# EAGLE board BB-cape (EAGLE 9.7.0)
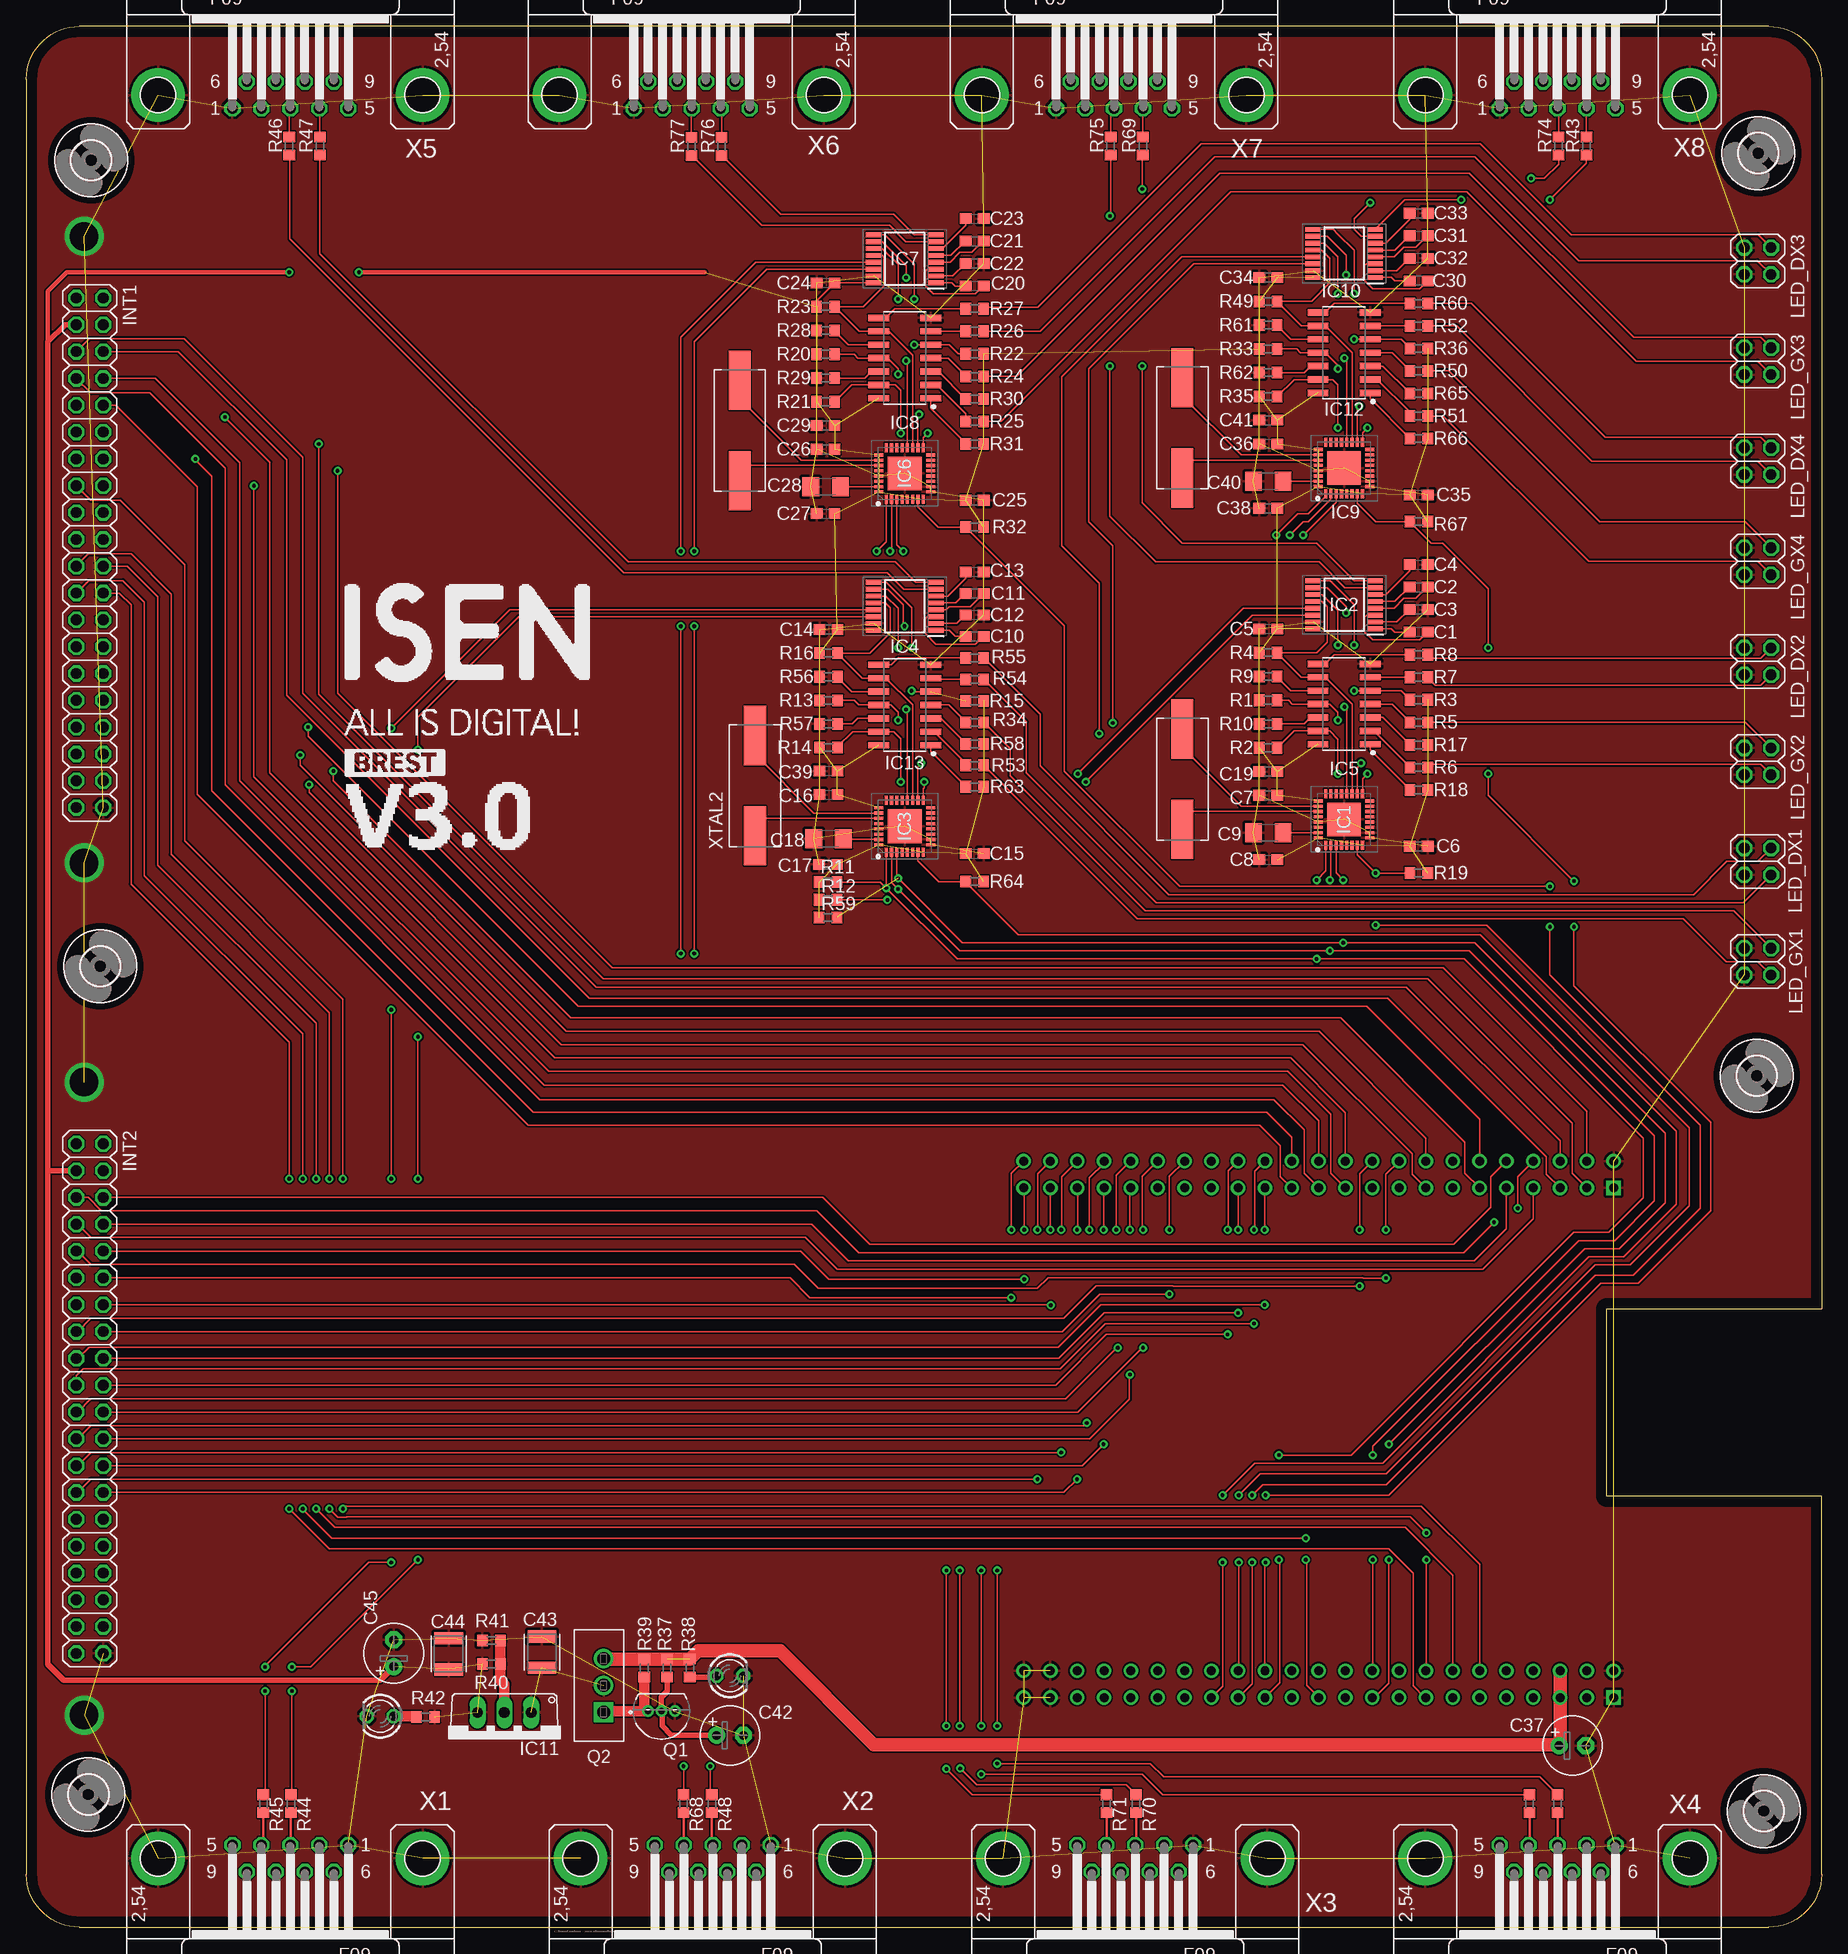
[diagram p2: board, top side]
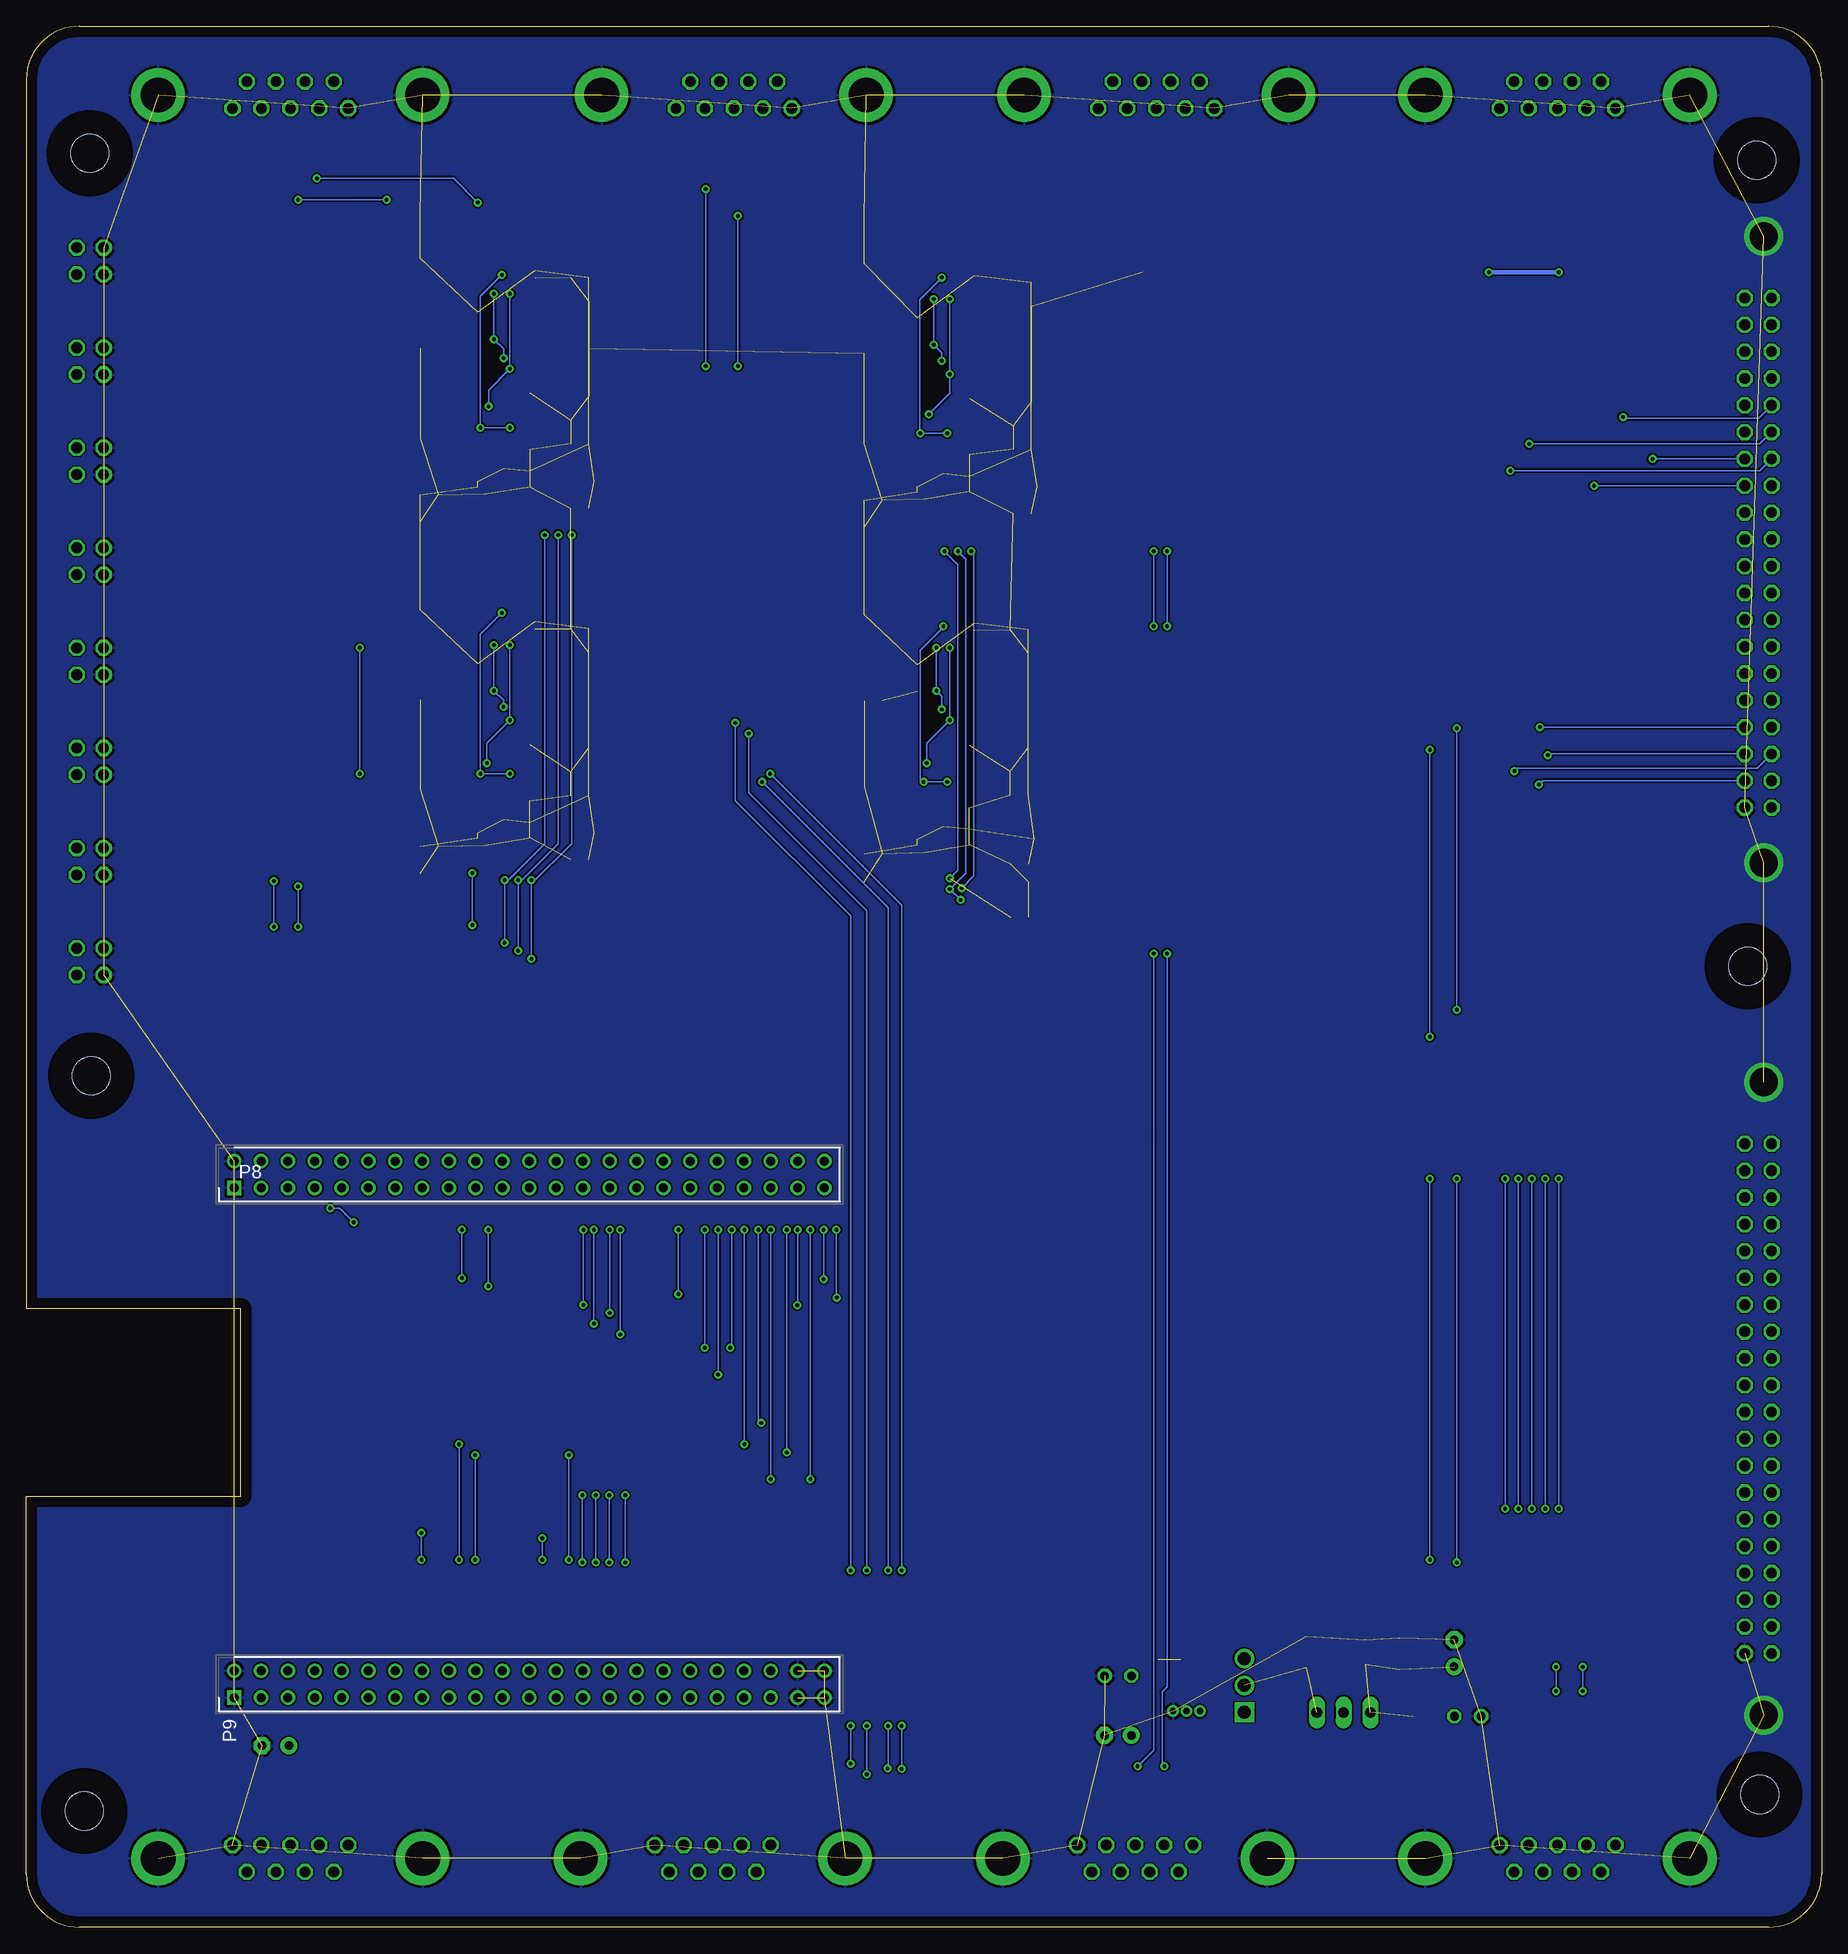
[diagram p3: board, bottom side, seen from below]

Size 170 x 180 mm. Coordinates in mm from the lower left corner, seen from the top.
Outline: 5,0 165,0 arc90 170,5 170,40.79 149.68,40.79 149.68,58.57 170,58.57 170,175 arc90 165,180 5,180 arc90 0,175 0,5 arc90 5,0
Copper layers (1*16): Top 0.035mm / dielectric 1.5mm / Bottom 0.035mm
Design rules "Fusion Electronics Design Rules": minimum track width 6mil, minimum drill 0.35mm, track to track 6mil, track to pad 6mil, pad to pad 6mil, via to via 6mil, smd to smd 6mil, copper to edge 40mil, drill to drill 6mil, minimum pad ring 10mil, minimum via ring 8mil, stop-mask expansion 4mil, vias tented up to drill 0mil, thermal gap 10mil

## Footprints (pad centres in the part's own frame; a part is rotated, then mirrored left to right if it is on the bottom)
C0603 = smd 1.1 x 1: 1 -0.85,0; 2 0.85,0
C1206 = smd 1.6 x 1.8: 1 -1.4,0; 2 1.4,0
E2,5-6 = drill 0.813 pad 1.6: + -1.27,0 | drill 0.813 pad 1.6 octagon: - 1.27,0
CAPC3225X135 = smd 1.165 x 2.715: 1 -1.475,0; 2 1.475,0
3,6 = hole 3.6: 0,0
QFN50P500X500X80-33N = smd 0.85 x 0.3: 1 -2.45,1.75; 2 -2.45,1.25; 3 -2.45,0.75; 4 -2.45,0.25; 5 -2.45,-0.25; 6 -2.45,-0.75; 7 -2.45,-1.25; 8 -2.45,-1.75; 17 2.45,-1.75; 18 2.45,-1.25; 19 2.45,-0.75; 20 2.45,-0.25; 21 2.45,0.25; 22 2.45,0.75; 23 2.45,1.25; 24 2.45,1.75 | smd 0.3 x 0.85: 9 -1.75,-2.45; 10 -1.25,-2.45; 11 -0.75,-2.45; 12 -0.25,-2.45; 13 0.25,-2.45; 14 0.75,-2.45; 15 1.25,-2.45; 16 1.75,-2.45; 25 1.75,2.45; 26 1.25,2.45; 27 0.75,2.45; 28 0.25,2.45; 29 -0.25,2.45; 30 -0.75,2.45; 31 -1.25,2.45; 32 -1.75,2.45 | smd 3.2 x 3.2: 33 0,0
SOP65P640X120-16N = smd 1.475 x 0.45: 1 -2.938,2.275; 2 -2.938,1.625; 3 -2.938,0.975; 4 -2.938,0.325; 5 -2.938,-0.325; 6 -2.938,-0.975; 7 -2.938,-1.625; 8 -2.938,-2.275; 9 2.938,-2.275; 10 2.938,-1.625; 11 2.938,-0.975; 12 2.938,-0.325; 13 2.938,0.325; 14 2.938,0.975; 15 2.938,1.625; 16 2.938,2.275
SOIC127P600X175-14N = smd 1.968 x 0.599: 1 -2.473,3.81; 2 -2.473,2.54; 3 -2.473,1.27; 4 -2.473,0; 5 -2.473,-1.27; 6 -2.473,-2.54; 7 -2.473,-3.81; 8 2.473,-3.81; 9 2.473,-2.54; 10 2.473,-1.27; 11 2.473,0; 12 2.473,1.27; 13 2.473,2.54; 14 2.473,3.81
TO220V = drill 1.016 long: 1 -2.54,-2.54; 2 0,-2.54; 3 2.54,-2.54
2X20 = drill 1.016 octagon: 1 -24.13,-1.27; 2 -24.13,1.27; 3 -21.59,-1.27; 4 -21.59,1.27; 5 -19.05,-1.27; 6 -19.05,1.27; 7 -16.51,-1.27; 8 -16.51,1.27; 9 -13.97,-1.27; 10 -13.97,1.27; 11 -11.43,-1.27; 12 -11.43,1.27; 13 -8.89,-1.27; 14 -8.89,1.27; 15 -6.35,-1.27; 16 -6.35,1.27; 17 -3.81,-1.27; 18 -3.81,1.27; 19 -1.27,-1.27; 20 -1.27,1.27; 21 1.27,-1.27; 22 1.27,1.27; 23 3.81,-1.27; 24 3.81,1.27; 25 6.35,-1.27; 26 6.35,1.27; 27 8.89,-1.27; 28 8.89,1.27; 29 11.43,-1.27; 30 11.43,1.27; 31 13.97,-1.27; 32 13.97,1.27; 33 16.51,-1.27; 34 16.51,1.27; 35 19.05,-1.27; 36 19.05,1.27; 37 21.59,-1.27; 38 21.59,1.27; 39 24.13,-1.27; 40 24.13,1.27
LED3MM = drill 0.813 octagon: A -1.27,0; K 1.27,0
2X02 = drill 1.016 octagon: 1 -1.27,-1.27; 2 -1.27,1.27; 3 1.27,-1.27; 4 1.27,1.27
HDRV46W64P254_2X23_5842X500X87 = drill 0.85 pad 1.275 square: 1 0,0 | drill 0.85 pad 1.275: 2 0,2.54; 3 2.54,0; 4 2.54,2.54; 5 5.08,0; 6 5.08,2.54; 7 7.62,0; 8 7.62,2.54; 9 10.16,0; 10 10.16,2.54; 11 12.7,0; 12 12.7,2.54; 13 15.24,0; 14 15.24,2.54; 15 17.78,0; 16 17.78,2.54; 17 20.32,0; 18 20.32,2.54; 19 22.86,0; 20 22.86,2.54; 21 25.4,0; 22 25.4,2.54; 23 27.94,0; 24 27.94,2.54; 25 30.48,0; 26 30.48,2.54; 27 33.02,0; 28 33.02,2.54; 29 35.56,0; 30 35.56,2.54; 31 38.1,0; 32 38.1,2.54; 33 40.64,0; 34 40.64,2.54; 35 43.18,0; 36 43.18,2.54; 37 45.72,0; 38 45.72,2.54; 39 48.26,0; 40 48.26,2.54; 41 50.8,0; 42 50.8,2.54; 43 53.34,0; 44 53.34,2.54; 45 55.88,0; 46 55.88,2.54
TO92-3 = drill 0.6: 1 1.27,0; 2 0,0; 3 -1.27,0
TO-220 = drill 1.23 pad 1.85: D 2.54,0; S 5.08,0 | drill 1.23 pad 1.85 square: G 0,0
R0603 = smd 1 x 1.1: 1 -0.85,0; 2 0.85,0
F09HP = drill 1.016 octagon: 1 -5.486,-1.27; 2 -2.743,-1.27; 3 0,-1.27; 4 2.743,-1.27; 5 5.486,-1.27; 6 -4.115,1.27; 7 -1.372,1.27; 8 1.372,1.27; 9 4.115,1.27 | drill 3.302 pad 5.08: G1 -12.522,0; G2 12.522,0
XTAL1147X477X420N = smd 5.6 x 2.1: 1 -4.75,0; 2 4.75,0

## Placement (x,y rotation side)
C1  100n  [C0603]  131.86,122.63 180 top
C2  100n  [C0603]  131.86,126.9 0 top
C3  100n  [C0603]  131.86,124.76 180 top
C4  100n  [C0603]  131.86,129.03 0 top
C5  100n  [C0603]  117.6,122.94 180 top
C6  100n  [C0603]  131.86,102.36 0 top
C7  100n  [C0603]  117.6,107.19 0 top
C8  100n  [C0603]  117.6,101.09 0 top
C9  [C1206]  117.6,103.63 180 top
C10  100n  [C0603]  89.81,122.23 180 top
C11  100n  [C0603]  89.81,126.29 0 top
C12  100n  [C0603]  89.81,124.26 180 top
C13  100n  [C0603]  89.81,128.33 0 top
C14  100n  [C0603]  75.96,122.88 180 top
C15  100n  [C0603]  89.81,101.66 0 top
C16  100n  [C0603]  75.96,107.25 0 top
C17  100n  [C0603]  75.91,100.64 0 top
C18  [C1206]  75.96,103.06 180 top
C19  100n  [C0603]  117.6,109.44 0 top
C20  100n  [C0603]  89.81,155.4 180 top
C21  100n  [C0603]  89.81,159.66 0 top
C22  100n  [C0603]  89.81,157.53 180 top
C23  100n  [C0603]  89.81,161.8 0 top
C24  100n  [C0603]  75.69,155.7 180 top
C25  100n  [C0603]  89.81,135.13 0 top
C26  100n  [C0603]  75.69,139.95 0 top
C27  100n  [C0603]  75.69,133.86 0 top
C28  [C1206]  75.69,136.4 180 top
C29  100n  [C0603]  75.69,142.2 0 top
C30  100n  [C0603]  131.86,155.91 180 top
C31  100n  [C0603]  131.86,160.17 0 top
C32  100n  [C0603]  131.86,158.04 180 top
C33  100n  [C0603]  131.86,162.31 0 top
C34  100n  [C0603]  117.6,156.21 180 top
C35  100n  [C0603]  131.86,135.64 0 top
C36  100n  [C0603]  117.6,140.46 0 top
C37  [E2,5-6]  146.42,17.19 0 top
C38  100n  [C0603]  117.6,134.37 0 top
C39  100n  [C0603]  75.96,109.48 0 top
C40  [C1206]  117.6,136.91 180 top
C41  100n  [C0603]  117.6,142.71 0 top
C42  [E2,5-6]  66.64,18.16 0 top
C43  [CAPC3225X135]  48.82,26.03 90 top
C44  [CAPC3225X135]  39.99,25.88 90 top
C45  [E2,5-6]  34.79,25.94 90 top
H1  MOUNT-HOLE3.6  [3,6]  5.87,12.56 0 top
H2  MOUNT-HOLE3.6  [3,6]  164.53,11 0 top
H3  MOUNT-HOLE3.6  [3,6]  7,91 0 top
H4  MOUNT-HOLE3.6  [3,6]  6.13,167.33 0 top
H5  MOUNT-HOLE3.6  [3,6]  163.87,80.63 0 top
H6  MOUNT-HOLE3.6  [3,6]  164,168 0 top
IC1  MAX3109ETJ+  [QFN50P500X500X80-33N]  124.79,104.9 90 top
IC2  MAX3232CPWR  [SOP65P640X120-16N]  124.79,125.22 180 top
IC3  MAX3109ETJ+  [QFN50P500X500X80-33N]  83.18,104.25 90 top
IC4  MAX3232CPWR  [SOP65P640X120-16N]  83.18,125.08 180 top
IC5  74HC14_SOIC  [SOIC127P600X175-14N]  124.79,115.82 180 top
IC6  MAX3109ETJ+  [QFN50P500X500X80-33N]  83.18,137.67 90 top
IC7  MAX3232CPWR  [SOP65P640X120-16N]  83.18,157.99 180 top
IC8  74HC14_SOIC  [SOIC127P600X175-14N]  83.18,148.59 180 top
IC9  MAX3109ETJ+  [QFN50P500X500X80-33N]  124.79,138.18 90 top
IC10  MAX3232CPWR  [SOP65P640X120-16N]  124.79,158.5 180 top
IC11  LM7805_TO220V  [TO220V]  45.26,17.8 180 top
IC12  74HC14_SOIC  [SOIC127P600X175-14N]  124.79,149.1 180 top
IC13  74HC14_SOIC  [SOIC127P600X175-14N]  83.18,115.74 180 top
INT1  [2X20]  6,130.15 270 top
INT2  [2X20]  6,50.05 270 top
LED1  TLLY4400  [LED3MM]  66.62,23.8 0 top
LED2  TLLY4400  [LED3MM]  33.5,19.97 180 top
LED_DX1  [2X02]  163.96,100.92 270 top
LED_DX2  [2X02]  163.96,119.87 270 top
LED_DX3  [2X02]  163.96,157.78 270 top
LED_DX4  [2X02]  163.96,138.83 270 top
LED_GX1  [2X02]  163.96,91.44 270 top
LED_GX2  [2X02]  163.96,110.39 270 top
LED_GX3  [2X02]  163.96,148.3 270 top
LED_GX4  [2X02]  163.96,129.35 270 top
P8  2076  [HDRV46W64P254_2X23_5842X500X87]  150.31,70 0 bottom
P9  2076  [HDRV46W64P254_2X23_5842X500X87]  150.31,21.74 0 bottom
Q1  BS170  [TO92-3]  60.14,20.46 180 top
Q2  IRF9540PBF  [TO-220]  54.66,20.35 90 top
R1  [R0603]  117.6,116.19 0 top
R2  [R0603]  117.6,111.69 0 top
R3  [R0603]  131.86,116.23 0 top
R4  [R0603]  117.6,120.69 180 top
R5  [R0603]  131.86,114.1 0 top
R6  [R0603]  131.86,109.83 0 top
R7  [R0603]  131.86,118.36 0 top
R8  [R0603]  131.86,120.5 0 top
R9  [R0603]  117.6,118.44 180 top
R10  [R0603]  117.6,113.94 180 top
R11  5k6  [R0603]  75.91,98.97 180 top
R12  5k6  [R0603]  75.91,97.3 0 top
R13  [R0603]  75.96,116.18 0 top
R14  [R0603]  75.96,111.71 0 top
R15  [R0603]  89.81,116.13 0 top
R16  [R0603]  75.96,120.64 180 top
R17  [R0603]  131.86,111.96 180 top
R18  [R0603]  131.86,107.7 180 top
R19  [R0603]  131.86,99.82 0 top
R20  [R0603]  75.69,148.95 0 top
R21  [R0603]  75.69,144.45 0 top
R22  [R0603]  89.81,149 0 top
R23  [R0603]  75.69,153.45 180 top
R24  [R0603]  89.81,146.86 0 top
R25  [R0603]  89.81,142.6 0 top
R26  [R0603]  89.81,151.13 0 top
R27  [R0603]  89.81,153.26 0 top
R28  [R0603]  75.69,151.2 180 top
R29  [R0603]  75.69,146.7 180 top
R30  [R0603]  89.81,144.73 180 top
R31  [R0603]  89.81,140.46 180 top
R32  [R0603]  89.81,132.59 0 top
R33  [R0603]  117.6,149.46 0 top
R34  [R0603]  89.81,114.09 0 top
R35  [R0603]  117.6,144.96 0 top
R36  [R0603]  131.86,149.5 0 top
R37  [R0603]  60.68,24.53 270 top
R38  [R0603]  62.82,24.53 90 top
R39  [R0603]  58.51,24.53 270 top
R40  [R0603]  44.03,24.92 180 top
R41  [R0603]  44.04,27.15 0 top
R42  [R0603]  37.8,19.91 0 top
R43  [R0603]  147.74,168.68 90 top
R44  [R0603]  25.06,11.69 270 top
R45  [R0603]  22.43,11.69 270 top
R46  [R0603]  24.89,168.68 90 top
R47  [R0603]  27.79,168.68 90 top
R48  [R0603]  64.91,11.69 270 top
R49  [R0603]  117.6,153.96 180 top
R50  [R0603]  131.86,147.37 0 top
R51  [R0603]  131.86,143.1 0 top
R52  [R0603]  131.86,151.64 0 top
R53  [R0603]  89.81,110.03 0 top
R54  [R0603]  89.81,118.16 0 top
R55  [R0603]  89.81,120.19 0 top
R56  [R0603]  75.96,118.41 180 top
R57  [R0603]  75.96,113.95 180 top
R58  [R0603]  89.81,112.06 180 top
R59  5k6  [R0603]  75.91,95.62 0 top
R60  [R0603]  131.86,153.77 0 top
R61  [R0603]  117.6,151.71 180 top
R62  [R0603]  117.6,147.21 180 top
R63  [R0603]  89.81,107.99 180 top
R64  [R0603]  89.81,99.02 0 top
R65  [R0603]  131.86,145.24 180 top
R66  [R0603]  131.86,140.97 180 top
R67  [R0603]  131.86,133.1 0 top
R68  [R0603]  62.21,11.69 270 top
R69  [R0603]  105.72,168.68 90 top
R70  [R0603]  105.1,11.69 270 top
R71  [R0603]  102.29,11.69 270 top
R72  [R0603]  145.01,11.69 270 top
R73  [R0603]  142.35,11.69 270 top
R74  [R0603]  145.1,168.68 90 top
R75  [R0603]  102.68,168.68 90 top
R76  [R0603]  65.84,168.64 90 top
R77  [R0603]  62.97,168.64 90 top
X1  [F09HP]  25,6.5 180 top
X2  [F09HP]  65,6.5 180 top
X3  [F09HP]  105,6.5 180 top
X4  [F09HP]  145,6.5 180 top
X5  [F09HP]  25,173.5 0 top
X6  [F09HP]  63,173.5 0 top
X7  [F09HP]  103,173.5 0 top
X8  [F09HP]  145,173.5 0 top
XTAL1  4MHz  [XTAL1147X477X420N]  109.47,108.71 270 top
XTAL2  4MHz  [XTAL1147X477X420N]  69.01,108.1 270 top
XTAL3  4MHz  [XTAL1147X477X420N]  67.56,141.73 270 top
XTAL4  4MHz  [XTAL1147X477X420N]  109.47,141.99 270 top

## Tracks (layer width: path | path; a pad name or v marks a point on that pad's centre or on a via)
+3V3  (via drill 0.35)  (77 unrouted)
  Top 0.152: C24.1 76.55,155.71 IC7.16
  Top 0.254: C24.1 74.84,154 R23.2
  Top 0.406: 2.03,150.11 2.03,154.94 3.81,156.72 v24.89,156.72 | v31.5,156.72 64.26,156.72
  Top 0.508: C45.+ 33.49,23.37 3.56,23.37 2.03,24.89 2.03,71.63 | 2.03,71.63 2.03,150.11 3.66,151.74 INT1.3 | INT2.3 4.72,71.63 2.03,71.63
  Bottom 0.406: v24.89,156.72 v31.5,156.72
  pour Top: 38.16,20.62 38.18,20.59 38.18,19.34 38.64,18.87 43.15,18.87 43.61,19.34 43.61,25.37 43.4,25.58 34.32,25.58 33.86,25.11 33.86,24.16 34.07,23.95 34.81,23.95 34.84,23.94
+5V  (1 unrouted)
  Top 1.27: P9.6 P9.5 145.24,17.27 C37.+ 145.06,17.27 80.26,17.27 71.37,26.16 63.61,26.16 R38.2 R39.1 54.71,25.38 Q2.S
AR_MOM  (via drill 0.35)
  Top 0.152: P8.21 123.5,71.42 123.5,77 119.46,81.04 49.45,81.04 21.54,108.94 v21.54,136.5
  Bottom 0.152: INT1.16 v21.54,136.5
DT_FMVT  (via drill 0.35)
  Top 0.152: v97,58.89 96.95,58.94 INT2.14 | v96.97,66.04 P8.43
  Bottom 0.152: v97,58.89 96.97,58.91 v96.97,66.04
DT_GO  (via drill 0.35)
  Top 0.152: INT1.21 4.73,128.94 5.84,130.05 9.91,130.05 13.72,126.24 13.72,101.6 28.7,86.61 v28.7,70.87 | v28.7,39.62 29.49,38.84 30.3,38.84 30.32,38.86 131.06,38.86 v132.59,37.34 | v132.59,34.8 132.59,24.33 P9.16
  Bottom 0.152: v28.7,70.87 v28.7,39.62 | v132.59,37.34 v132.59,34.8
DT_RST  (via drill 0.35)
  Top 0.152: P8.4 147.78,77.27 134.19,90.86 55.47,90.86 29.46,116.86 v29.46,137.92
  Bottom 0.152: INT1.13 5.85,137.92 v29.46,137.92
DT_RX  (via drill 0.35)
  Top 0.152: IC10.8 130.53,163.58 v135.89,163.58 | v144.27,163.58 147.74,167.04 R43.1
  Bottom 0.152: v135.89,163.58 v144.27,163.58
DT_TX  (via drill 0.35)
  Top 0.152: IC10.7 126.39,160.12 125.73,160.78 125.73,161.8 v127.25,163.32 | v142.49,165.61 143.76,165.61 145.1,166.94 R74.1
  Bottom 0.152: v127.25,163.32 129.54,165.61 v142.49,165.61
DT_ZERO  (via drill 0.35)
  Top 0.152: INT2.22 99.58,48.78 105.66,54.86 v105.75,54.86 | v105.75,66.04 105.66,66.13 105.66,71.12 107.08,72.54 P8.36
  Bottom 0.152: v105.75,66.04 v105.75,54.86
DX_FMVT
  Top 0.152: INT2.8 74.36,66.56 77.83,63.09 137.09,63.09 140.16,66.16 P8.9
DX_GO  (via drill 0.35)
  Top 0.152: INT1.24 8.79,126.34 9.91,125.22 9.91,98.78 24.89,83.79 v24.89,70.87 | v24.89,39.62 28.7,35.81 129.03,35.81 131.32,33.53 131.32,22.86 132.44,21.74 P9.15
  Bottom 0.152: v24.89,70.87 v24.89,39.62
DX_RST
  Top 0.152: P8.23 121,71.38 121,75.5 118.13,78.37 48.61,78.37 18.82,108.17 18.82,138.18 11.7,145.29 6.1,145.29 INT1.7
DX_RX
  Top 0.152: IC4.8 84.23,127.36 82.3,129.29 56.98,129.29 27.79,158.48 R47.1
DX_TX
  Top 0.152: IC4.7 83.1,126.7 81.53,128.27 56.55,128.27 24.94,159.88 24.94,167.77 R46.1
DX_ZERO  (via drill 0.35)
  Top 0.152: INT2.23 4.87,46.24 6.11,47.48 100.38,47.48 100.42,47.52 v100.42,47.75 | v100.67,66.04 100.67,70.95 102.06,72.34 P8.40
  Bottom 0.152: v100.67,66.04 100.67,48.01 v100.42,47.75
DY_FMVT  (via drill 0.35)
  Top 0.152: INT2.10 73.31,64.02 75.98,61.35 v94.5,61.35 | v94.5,66.04 94.5,69.94 P8.45
  Bottom 0.152: v94.5,66.04 v94.5,61.35
DY_GO  (via drill 0.35)
  Top 0.152: INT1.23 5.9,127.51 9.14,127.51 11.18,125.48 11.18,99.57 26.16,84.58 v26.16,70.87 | v26.16,39.62 26.16,39.56 28.9,36.83 v121.16,36.83 | P9.23 122.38,21.76 121.24,22.9 121.24,34.72 v121.16,34.8
  Bottom 0.152: v26.16,70.87 v26.16,39.62 | v121.16,36.83 v121.16,34.8
DY_RST  (via drill 0.35)
  Top 0.152: P8.22 124.92,77.14 119.75,82.31 50.06,82.31 23.07,109.3 23.07,138.73 v18.8,143
  Bottom 0.152: v18.8,143 18.7,142.9 5.95,142.9 INT1.9
DY_RX
  Top 0.152: IC7.8 84.08,160.26 82.15,162.2 71.43,162.2 R76.1
DY_TX
  Top 0.152: IC7.7 83.29,159.61 81.74,161.16 69.65,161.16 63.02,167.79 R77.1
DY_ZERO  (via drill 0.35)
  Top 0.152: v104.5,52.32 104.45,52.27 104.45,49.98 100.7,46.24 INT2.24 | v104.5,66.04 104.5,69.91 P8.37
  Bottom 0.152: v104.5,66.04 v104.5,52.32
DZ_FMVT  (via drill 0.35)
  Top 0.152: INT2.12 72.33,61.48 74.19,59.61 v93.27,59.61 | P8.46 93.29,71.39 v93.29,66.04
  Bottom 0.152: v93.29,66.04 93.29,59.63 v93.27,59.61
DZ_GO  (via drill 0.35)
  Top 0.152: INT1.22 9.55,128.88 12.45,125.98 12.45,100.58 27.43,85.6 v27.43,70.87 | v27.43,39.62 29.21,37.85 130.56,37.85 135.07,33.33 P9.14
  Bottom 0.152: v27.43,70.87 v27.43,39.62
DZ_RST  (via drill 0.35)
  Top 0.152: P8.3 146.39,71.38 146.39,76.11 132.69,89.81 54.64,89.81 27.69,116.77 v27.69,140.46
  Bottom 0.152: INT1.11 5.85,140.46 v27.69,140.46
DZ_RX  (via drill 0.35)
  Top 0.152: IC2.8 125.74,127.5 122.17,131.06 109.47,131.06 105.66,134.87 v105.66,147.83 | 105.66,167.82 105.67,167.83 R69.1 105.66,167.77 v105.66,164.59
  Bottom 0.152: v105.66,164.59 v105.66,147.83
DZ_TX  (via drill 0.35)
  Top 0.152: IC2.7 124.87,126.85 122.43,129.29 106.93,129.29 102.62,133.6 v102.62,147.83 | v102.62,162.05 102.69,162.12 R75.1
  Bottom 0.152: v102.62,162.05 v102.62,147.83
DZ_ZERO  (via drill 0.35)
  Top 0.152: INT2.21 4.87,48.78 6.11,50.02 98.43,50.02 103.28,54.86 v103.35,54.86 | v103.2,66.04 103.2,71.2 104.54,72.54 P8.38
  Bottom 0.152: v103.35,54.86 103.2,55.01 v103.2,66.04
GND  (via drill 2.69 pad 3)  (126 unrouted)
  other vias: 5.47,20.08 5.47,100.78 5.47,160.12 5.47,80.02
  pour Top: -2.48,-11.87 171.24,-11.87 171.24,191.12 -2.48,191.12
  pour Bottom: -2.43,-11.62 171.31,-11.62 171.31,191.43 -2.43,191.43
GT_FMVT
  Top 0.152: INT2.6 75.41,69.1 79.84,64.67 135.17,64.67 138.69,68.19 138.69,71.08 P8.10
GT_GO  (via drill 0.35)
  Top 0.152: P8.15 131.25,71.28 131.25,73.22 120.89,83.58 50.66,83.58 26.77,107.47 v26.77,108.2
  Bottom 0.152: INT1.38 26.41,108.56 v26.77,108.2
GT_RST
  Top 0.152: P8.6 145.24,74.47 130.68,89.03 53.98,89.03 26.16,116.84 26.16,139.19 14.94,150.42 5.95,150.42 INT1.5
GT_RX  (via drill 0.35)
  Top 0.152: IC10.13 109.4,158.17 98.04,146.81 98.04,130.81 101.6,127.25 v101.6,113.03 | R73.1 107.6,12.54 105.66,14.48 v90.42,14.48 | v90.42,19.05 v90.42,33.78
  Bottom 0.152: v90.42,14.48 v90.42,19.05 | v90.42,33.78 90.42,96.27 101.6,107.44 v101.6,113.03
GT_TX  (via drill 0.35)
  Top 0.152: IC10.14 110.53,157.52 100.58,147.57 100.58,133.1 102.87,130.81 v102.87,114.05 | R72.1 143.32,14.22 107.7,14.22 106.43,15.49 v91.95,15.49 | v91.95,19.05 v91.95,33.78
  Bottom 0.152: v91.95,15.49 v91.95,19.05 | v91.95,33.78 91.95,95.76 102.87,106.68 v102.87,114.05
GT_ZERO  (via drill 0.35)
  Top 0.152: v102,45.72 99.98,43.7 INT2.26 | v102,66.04 102,69.95 P8.39
  Bottom 0.152: v102,66.04 v102,45.72
GX_FMVT  (via drill 0.35)
  Top 0.152: INT2.9 4.87,64.02 6.11,62.78 72.72,62.78 74.98,60.52 95.75,60.52 96.75,61.52 126.55,61.52 126.6,61.47 v128.75,61.47 | v128.75,66.04 128.75,71.3 P8.18
  Bottom 0.152: v128.75,66.04 v128.75,61.47
GX_GO  (via drill 0.35)
  Top 0.152: P8.12 137.62,76.51 126.92,87.2 52.27,87.2 26.67,112.8 v26.67,113.64
  Bottom 0.152: INT1.34 v26.67,113.64
GX_RST
  Top 0.152: P8.25 118.75,71.08 118.75,74.01 116.81,75.95 47.54,75.95 16.2,107.29 16.2,136.4 8.47,144.12 INT1.10
GX_RX  (via drill 0.35)
  Top 0.152: IC4.13 45.76,124.75 v34.54,113.54 | v34.54,86.87 v34.54,70.87 | v22.61,22.35 22.61,12.71 R45.1 | v34.54,34.54 32.42,34.54 22.61,24.73 v22.61,24.64
  Bottom 0.152: v34.54,113.54 v34.54,86.87 | v34.54,70.87 v34.54,34.54 | v22.61,24.64 v22.61,22.35
GX_TX  (via drill 0.35)
  Top 0.152: IC4.14 46.63,124.11 37.08,114.55 v37.08,111.51 | v37.08,84.33 v37.08,70.87 | v37.08,34.8 26.92,24.64 v25.15,24.64 | v25.15,22.35 25.15,12.63 R44.1
  Bottom 0.152: v37.08,111.51 v37.08,84.33 | v37.08,70.87 v37.08,34.8 | v25.15,24.64 v25.15,22.35
GX_ZERO  (via drill 0.35)
  Top 0.152: INT2.27 4.87,41.16 6.11,42.4 95.72,42.4 95.72,42.39 v95.75,42.42 | v95.75,66.04 v95.76,66.05 95.76,71.32 P8.44
  Bottom 0.152: v95.75,66.04 v95.75,42.42
GY_FMVT
  Top 0.152: INT2.7 4.87,66.56 6.11,65.32 73.77,65.32 76.79,62.31 137.9,62.31 142.69,67.1 P8.7
GY_GO  (via drill 0.35)
  Top 0.152: P8.11 136.23,71.38 136.23,74.33 124.45,86.12 51.55,86.12 29.08,108.58 v29.08,109.47
  Bottom 0.152: INT1.35 6.1,109.73 28.83,109.73 v29.08,109.47
GY_RST
  Top 0.152: P8.24 122.38,76.34 119,79.72 49.05,79.72 20.2,108.58 20.2,138.68 12.22,146.66 INT1.8
GY_RX  (via drill 0.35)
  Top 0.152: IC7.13 69.09,157.66 61.98,150.55 v61.98,130.3 | v61.98,123.19 v61.98,92.2 | v62.23,15.24 62.23,12.56 R68.1
  Bottom 0.152: v61.98,130.3 v61.98,123.19 | v61.98,92.2 61.98,22.78 62.45,22.31 62.45,15.46 v62.23,15.24
GY_TX  (via drill 0.35)
  Top 0.152: IC7.14 70.1,157.01 63.25,150.16 v63.25,130.3 | v63.25,123.19 v63.25,92.2 | v64.77,15.24 64.77,12.68 R48.1
  Bottom 0.152: v63.25,130.3 v63.25,123.19 | v63.25,92.2 63.25,74.93 63.25,16.76 v64.77,15.24
GY_ZERO  (via drill 0.35)
  Top 0.152: v99.5,42.42 98.25,41.16 INT2.28 | v99.5,66.04 99.57,66.04 99.57,69.95 P8.41
  Bottom 0.152: v99.5,66.04 v99.5,42.42
GZ_FMVT  (via drill 0.35)
  Top 0.152: INT2.5 5.87,69.1 7.11,67.86 74.83,67.86 78.8,63.88 136.13,63.88 v139,66.75 | v141.22,68.07 141.22,71.07 P8.8
  Bottom 0.152: v139,66.75 140.32,68.07 v141.22,68.07
GZ_GO  (via drill 0.35)
  Top 0.152: P8.16 132.53,74.73 122.41,84.85 51.11,84.85 25.93,110.03 v25.93,111
  Bottom 0.152: INT1.36 25.83,111.1 v25.93,111
GZ_RST
  Top 0.152: P8.5 143.94,71.29 143.94,72.97 128.93,87.99 53.32,87.99 24.64,116.67 24.64,138.94 14.38,149.2 INT1.6
GZ_RX  (via drill 0.35)
  Top 0.152: R71.1 89.57,12.54 v87.12,14.99 | v87.12,19.05 v87.12,33.78 | IC2.13 115.25,124.9 v99.57,109.22
  Bottom 0.152: v87.12,14.99 v87.12,19.05 | v87.12,33.78 87.12,96.77 v99.57,109.22
GZ_TX  (via drill 0.35)
  Top 0.152: R70.1 104.17,13.46 90.01,13.46 v88.44,15.03 | v88.39,19.05 v88.39,33.78 | IC2.14 116.09,124.25 100.33,108.49 v100.33,108.46
  Bottom 0.152: v88.39,33.78 88.39,96.52 v100.33,108.46 | v88.44,15.03 88.39,15.08 v88.39,19.05
GZ_ZERO  (via drill 0.35)
  Top 0.152: INT2.25 4.87,43.7 6.11,44.94 97.96,44.94 97.98,44.96 v98,44.96 | v98,66.04 98.04,66.04 98.04,71.07 P8.42
  Bottom 0.152: v98,66.04 v98,44.96
INFO_AR_URG  (via drill 0.35)
  Top 0.152: INT2.16 98.09,56.4 101.64,59.94 v108.25,59.94 | v108.25,66.04 108.25,71.11 P8.34
  Bottom 0.152: v108.25,59.94 v108.25,66.04
IRQ_T_N  (via drill 0.35)
  Top 0.152: IC9.7 126.03,134.82 127.76,133.1 R67.1 133.04,131.06 134.11,131.06 138.43,126.75 v138.43,121.16 | v146.56,99.06 138.43,107.19 v138.43,109.22 | v146.56,94.74 146.56,89.15 159.51,76.2 159.51,67.82 152.65,60.96 149.1,60.96 129.03,40.89 v117.35,40.89 | P9.28 117.3,34.49 v117.35,34.54
  Bottom 0.152: v138.43,121.16 v138.43,109.22 | v146.56,99.06 v146.56,94.74 | v117.35,34.54 v117.35,40.89
IRQ_X_N  (via drill 0.35)
  Top 0.152: IC3.7 84.43,100.99 86.4,99.02 R64.1 88.96,98.97 93.94,93.98 137.67,93.98 156.26,75.39 156.26,68.47 151.26,63.47 147.96,63.47 128.43,43.94 116.33,43.94 v113.28,40.89 | P9.31 113.28,22.81 v113.28,34.54
  Bottom 0.152: v113.28,34.54 v113.28,40.89
IRQ_Y_N  (via drill 0.35)
  Top 0.152: IC6.7 84.43,134.52 86.36,132.59 R32.1 98.3,123.25 98.3,109.47 109.22,98.55 v144.27,98.55 | v144.27,94.74 144.27,90.17 158.5,75.95 158.5,68.07 152.15,61.72 148.59,61.72 128.78,41.91 117.09,41.91 v116.08,40.89 | P9.29 116.08,23.06 v116.08,34.54
  Bottom 0.152: v144.27,98.55 v144.27,94.74 | v116.08,34.54 v116.08,40.89
IRQ_Z_N  (via drill 0.35)
  Top 0.152: IC1.7 126.03,101.55 v127.76,99.82 R19.1 | v127.76,94.9 138.28,94.9 157.48,75.69 157.48,68.33 151.89,62.74 148.59,62.74 128.78,42.93 116.84,42.93 v114.81,40.89 | v114.81,34.54 114.81,24.33 P9.30
  Bottom 0.152: v127.76,99.82 v127.76,94.9 | v114.81,40.89 v114.81,34.54
N$1
  Top 0.152: IC2.2 129.79,123.6 130.96,124.77 C3.2
N$2
  Top 0.152: IC2.3 126.91,124.25 126.76,124.09 126.76,122.63 127.48,121.9 131.93,121.9 132.66,122.63 C1.1
N$3
  Top 0.152: IC2.5 129.61,125.55 130.96,126.9 C2.1
N$4
  Top 0.152: IC2.6 128.75,126.2 131.01,128.46 C4.1
N$5
  Top 0.152: IC1.26 115.03,106.15 109.47,111.71 XTAL1.1
N$6
  Top 0.152: XTAL1.2 109.47,105.49 109.64,105.65 IC1.27
N$7
  Top 0.508: C42.+ 61.08,18.16 60.2,19.05 60.2,20.4 Q1.2 60.14,21.79 60.68,22.33 R37.2
N$8
  Top 0.152: R8.2 133.05,120.15 164.24,120.15 LED_DX2.2
N$9
  Top 0.152: R7.2 132.71,118.31 133.41,117.61 164.24,117.61 LED_DX2.4
N$10
  Top 0.152: R5.2 162.79,114.1 LED_GX2.2
N$11
  Top 0.508: R38.1 65.23,23.68 LED1.A
N$12
  Top 0.152: IC4.2 88.1,123.45 88.91,124.26 C12.2
N$13
  Top 1.016: R39.2 58.51,20.82 Q1.1 54.77,20.46 Q2.G
N$14
  Top 0.152: R6.2 132.99,110.11 164.24,110.11 LED_GX2.4
N$15
  Top 0.152: C9.1 122.31,103.63 IC1.31
N$16
  Top 0.152: IC4.3 85.3,124.11 85.15,123.95 85.15,122.48 86.14,121.5 89.88,121.5 90.61,122.23 C10.1
N$17
  Top 0.152: IC4.5 88.02,125.41 88.91,126.3 C11.1
N$18
  Top 0.152: IC4.6 87.26,126.06 88.96,127.75 C13.1
N$19
  Top 0.152: IC3.26 74.58,105.5 69.01,111.08 XTAL2.1
N$20
  Top 0.152: XTAL2.2 69.01,104.59 69.42,105 IC3.27
N$21  (2 unrouted)
  Top 1.016: 48.77,24.51 C43.1
  pour Top: 47.32,21.57 47.31,21.55 47.07,21.3 47.07,19.34 47.53,18.87 47.97,18.87 51.01,21.91 51.04,21.92 54.83,21.92 55.55,22.64 55.55,23.08 54.83,23.8 51.55,23.8 51.52,23.81 50.26,25.07 47.32,25.07
N$22
  Top 1.016: IC11.2 45.26,23.01 44.88,23.39 R40.1 44.88,27.13 R41.2
N$23  (via drill 0.35)
  Top 0.152: R2.2 120.05,113.28 IC5.13 123.41,113.28 124.21,112.49 v124.21,109.22 | IC1.17 126.53,108.75 v127,109.22 | IC2.10 123.17,126.85 124.97,125.05 v124.97,124.46
  Bottom 0.152: v124.21,109.22 v127,109.22 127,122.43 v124.97,124.46
N$24  (via drill 0.35)
  Top 0.152: R1.2 119.53,116.19 119.89,115.82 IC5.11 123.44,115.82 124.21,115.06 v124.21,114.3 | IC1.18 126.03,109.78 126.39,110.14 v126.39,110.24 | IC2.11 122.72,126.2 124.21,124.71 v124.21,121.41
  Bottom 0.152: v126.39,110.24 126.39,112.11 v124.21,114.3 v124.21,121.41
N$25
  Top 0.152: IC1.19 125.53,115.83 123,118.36 IC5.9 120.72,118.36 118.45,120.64 R4.1 122.21,120.69 123.19,121.67 123.19,125.02 122.66,125.55 IC2.12
N$26
  Top 0.152: R55.2 96.01,114.84 96.01,109.98 108.2,97.79 157.9,97.79 161.04,100.92 163.96,100.92 LED_DX1.2
N$27  (via drill 0.35)
  Top 0.152: R3.1 131.01,116.28 130.19,117.09 IC5.5 v125.73,117.09 | IC2.9 123.45,127.5 125.73,125.22 v125.73,121.41 | IC1.20 125.03,115.25 124.81,115.47 v124.81,115.57
  Bottom 0.152: v125.73,121.41 v125.73,117.09 124.81,116.18 v124.81,115.57
N$28
  Top 0.152: R17.2 131.01,112.01 128.47,114.55 IC5.3
N$29
  Top 0.152: R18.2 131.01,107.75 127.26,111.5 IC5.1
N$30
  Top 0.152: C1.2 129.57,122.63 129.25,122.95 IC2.1
N$31
  Top 0.254: R44.2 25.06,7.83 X1.3
N$32
  Top 1.016: LED2.A 36.89,19.97 R42.1
N$33
  Top 0.254: R45.2 22.43,7.95 X1.4
N$34
  Top 0.152: C2.2 132.66,126.9 131.59,125.83 130.46,125.83 129.52,124.9 IC2.4
N$35
  Top 0.152: IC5.4 129.33,115.82 131.01,114.15 R5.1
N$36
  Top 0.152: IC5.2 127.6,113.28 131.01,109.88 R6.1
N$37
  Top 0.152: IC5.6 R7.1
N$38
  Top 0.152: IC5.8 123,119.63 123.86,120.5 R8.1
N$39
  Top 0.152: IC5.10 119.75,117.09 118.45,118.39 R9.1
N$40
  Top 0.152: IC5.12 121.63,114.55 121.01,113.94 R10.1
N$41
  Top 0.152: IC7.2 87.74,156.36 88.91,157.53 C22.2
N$42
  Top 0.152: IC7.3 85.3,157.01 85.15,156.86 85.15,155.39 85.88,154.67 89.88,154.67 90.61,155.4 C20.1
N$43
  Top 0.152: IC7.5 87.56,158.31 88.91,159.66 C21.1
N$44
  Top 0.152: IC7.6 86.75,158.96 88.96,161.17 C23.1
N$45
  Top 0.152: IC6.26 73.38,138.92 67.56,144.73 XTAL3.1
N$46
  Top 0.152: XTAL3.2 67.56,138 67.98,138.42 IC6.27
N$47
  Top 0.152: LED_DX3.2 164,160.27 146.3,160.27 137.67,168.91 111.25,168.91 95.76,153.42 90.81,153.42 R27.2
N$48
  Top 0.152: R26.2 96.01,151.13 112.52,167.64 137.16,167.64 146.99,157.81 163.93,157.81 LED_DX3.4
N$49
  Top 0.152: R24.2 93.78,146.86 113.03,166.12 136.65,166.12 152.2,150.56 164.24,150.56 LED_GX3.2
N$50
  Top 0.152: R25.2 92.3,142.6 114.05,164.34 136.4,164.34 152.43,148.3 163.96,148.3 LED_GX3.4
N$51
  Top 0.152: C28.1 80.71,136.4 IC6.31
N$52  (via drill 0.35)
  Top 0.152: R21.2 78.14,146.05 IC8.13 82.3,146.05 82.8,145.54 v82.8,141.48 | IC6.17 84.93,141.06 v85.34,141.48 | IC7.10 81.06,159.61 83.31,157.36 v83.31,156.21
  Bottom 0.152: v82.8,141.48 v85.34,141.48 85.4,141.53 85.4,154.12 v83.31,156.21
N$53  (via drill 0.35)
  Top 0.152: R20.2 78.38,148.95 78.74,148.59 IC8.11 81.55,148.59 82.55,147.59 v82.55,147.07 | IC7.11 81.06,158.96 82.55,157.47 v82.55,154.18 | IC6.18 84.43,143.15 v84.54,143.26
  Bottom 0.152: v82.55,154.18 v82.55,147.07 82.55,145.24 v84.54,143.26
N$54
  Top 0.152: IC7.12 81.06,158.31 81.21,158.16 81.21,155.39 79.27,153.45 R23.1 78.86,151.13 IC8.9 81.64,151.13 83.93,148.84 IC6.19
N$55  (via drill 0.35)
  Top 0.152: R22.1 88.24,149 87.38,149.86 IC8.5 v84.07,149.86 | IC7.9 81.27,160.26 81.28,160.27 84.07,157.48 v84.07,154.18 | IC6.20 83.43,148.22 v83.31,148.34
  Bottom 0.152: v84.07,154.18 v84.07,149.86 83.31,149.1 v83.31,148.34
N$56
  Top 0.152: R30.2 88.93,144.73 86.34,147.32 IC8.3
N$57
  Top 0.152: R31.2 88.96,140.51 85.65,143.82 IC8.1
N$58
  Top 0.152: C20.2 87.96,155.4 87.65,155.71 IC7.1
N$59
  Top 0.152: C21.2 90.61,159.66 89.54,158.6 88.41,158.6 87.47,157.66 IC7.4
N$60
  Top 0.152: IC8.4 87.28,148.59 88.96,146.91 R24.1
N$61
  Top 0.152: IC8.2 86.23,146.05 88.96,143.32 R25.1
N$62
  Top 0.152: R26.1 IC8.6
N$63
  Top 0.152: IC8.8 81.39,152.4 82.25,153.26 R27.1
N$64
  Top 0.152: IC8.10 77.83,149.86 76.54,151.15 R28.1
N$65
  Top 0.152: IC8.12 80.02,147.32 79.4,146.7 R29.1
N$66
  Top 0.152: IC10.2 129.79,156.87 130.96,158.04 C32.2
N$67
  Top 0.152: IC10.3 126.91,157.52 126.76,157.37 126.76,155.9 127.48,155.18 131.93,155.18 132.66,155.91 C30.1
N$68
  Top 0.152: IC10.5 129.61,158.82 130.96,160.17 C31.1
N$69
  Top 0.152: IC10.6 128.75,159.47 131.01,161.73 C33.1
N$70
  Top 0.152: R54.2 94.69,114.13 94.69,109.33 106.99,97.03 162.61,97.03 LED_DX1.4
N$71
  Top 0.152: R34.2 93.16,111.59 93.16,109.05 105.94,96.27 161.67,96.27 LED_GX1.2
N$72
  Top 0.152: IC9.26 115.03,139.43 109.47,144.99 XTAL4.1
N$73
  Top 0.152: R53.2 105.18,95.5 156.92,95.5 160.98,91.44 163.96,91.44 LED_GX1.4
N$74
  Top 0.152: C18.1 77.41,103 IC3.31
N$75
  Top 0.152: XTAL4.2 109.47,138.93 IC9.27
N$76
  Top 0.152: R60.2 136.82,153.77 149.5,141.09 164.24,141.09 LED_DX4.2
N$77  (via drill 0.35)
  Top 0.152: IC3.17 84.93,107.79 85.03,107.89 v85.03,108.46 | v82.8,108.46 82.8,112.52 82.13,113.2 IC13.13 78.25,113.2 76.81,111.76 R14.2 | IC4.10 81.56,126.7 83.06,125.21 83.06,123.29 v83.16,123.19
  Bottom 0.152: v83.16,123.19 83.16,123.09 85.34,120.91 85.34,108.46 | 85.34,108.46 v85.03,108.46 | 85.34,108.46 v82.8,108.46
N$78
  Top 0.152: R46.2 24.89,172.12 X5.3
N$79  (via drill 0.35)
  Top 0.152: v82.55,114.3 82.55,115.06 81.87,115.74 IC13.11 78.83,115.74 78.39,116.18 R13.2 | IC4.11 81.39,126.06 82.55,124.89 v82.55,121.16 | IC3.18 84.43,108.2 84.43,108.21 84.43,109.83 84.73,110.13 v84.73,110.24
  Bottom 0.152: v82.55,121.16 v82.55,114.3 84.73,112.12 v84.73,110.24
N$80
  Top 0.152: R52.2 135.45,151.64 148.26,138.83 163.96,138.83 LED_DX4.4
N$81
  Top 0.152: IC3.19 83.93,115.74 81.39,118.28 IC13.9 79.18,118.28 R16.1 79.88,120.64 81.79,122.56 81.79,124.97 81.35,125.41 IC4.12
N$82
  Top 0.152: R50.2 134.69,147.37 148.99,133.07 162.77,133.07 LED_GX4.2
N$83
  Top 0.152: R51.2 134.18,143.1 147.94,129.35 163.96,129.35 LED_GX4.4
N$84  (via drill 0.35)  (1 unrouted)
  Top 0.152: IC4.9 81.43,127.36 83.82,124.97 v83.82,121.16 | v83.82,117.09 83.82,117.06 83.88,117.01 IC13.5 | IC3.20 83.43,115.2 v83.31,115.32
  Bottom 0.152: v83.82,121.16 v83.82,117.09 83.31,116.59 v83.31,115.32
N$85
  Top 0.152: C40.1 122.31,136.91 IC9.31
N$86  (via drill 0.35)
  Top 0.152: R35.2 120.05,146.56 IC12.13 123.7,146.56 124.21,146.05 v124.21,141.99 | IC9.17 126.53,141.52 v127,141.99 | IC10.10 123.17,160.12 124.97,158.32 v124.97,156.46
  Bottom 0.152: v124.21,141.99 v127,141.99 127,154.43 v124.97,156.46
N$87
  Top 0.152: R58.2 88.96,112.11 86.6,114.47 IC13.3
N$88  (via drill 0.35)
  Top 0.152: R33.2 120.29,149.46 120.65,149.1 IC12.11 123,149.1 124.21,147.89 v124.21,147.57 | IC9.18 126.03,143.81 v126.24,144.02 | IC10.11 122.92,159.47 124.21,158.18 v124.21,154.69
  Bottom 0.152: v126.24,144.02 126.24,145.54 v124.21,147.57 v124.21,154.69
N$89
  Top 0.152: IC9.19 125.53,149.1 123,151.64 IC12.9 120.72,151.64 118.45,153.91 R49.1 121.7,153.96 123.44,155.7 123.44,158.04 122.66,158.82 IC10.12
N$90
  Top 0.152: R63.2 88.96,108.04 85.65,111.35 IC13.1
N$91  (via drill 0.35)
  Top 0.152: R36.1 131.01,149.55 130.19,150.37 IC12.5 v125.73,150.37 | IC10.9 123.74,160.77 124.19,160.32 124.2,160.32 125.73,158.79 v125.73,154.69 | IC9.20 125.03,148.27 124.81,148.49 v124.81,148.59
  Bottom 0.152: v125.73,154.69 v125.73,150.37 124.81,149.45 v124.81,148.59
N$92
  Top 0.152: R65.2 131.01,145.29 128.47,147.83 IC12.3
N$93
  Top 0.152: R47.2 27.79,172.19 X5.4
N$94
  Top 0.254: R48.2 64.91,7.86 X2.3
N$95
  Top 0.254: R68.2 62.26,10.79 X2.4
N$96
  Top 0.254: R70.2 105.1,7.87 X3.3
N$97
  Top 0.254: R71.2 102.29,7.8 X3.4
N$98
  Top 0.152: R69.2 105.72,172.21 X7.4
N$99
  Top 0.254: R72.2 X4.3
N$100
  Top 0.254: R73.2 142.35,7.86 X4.4
N$101
  Top 0.152: R66.2 131.01,141.02 127.26,144.77 IC12.1
N$102
  Top 0.152: C30.2 129.57,155.91 129.25,156.22 IC10.1
N$103
  Top 0.152: C31.2 132.66,160.17 131.59,159.11 130.46,159.11 129.52,158.17 IC10.4
N$104
  Top 0.152: IC12.4 129.33,149.1 131.01,147.42 R50.1
N$105
  Top 0.152: IC12.2 127.94,146.56 131.01,143.49 R51.1
N$106
  Top 0.152: IC12.6 R52.1
N$107
  Top 0.152: C10.2 87.97,122.23 87.39,122.81 IC4.1
N$108
  Top 0.152: C11.2 90.61,126.3 89.36,125.05 87.38,125.05 87.08,124.75 IC4.4
N$109
  Top 0.152: R74.2 145.1,172.13 X8.3
N$110
  Top 0.152: R43.2 X8.4
N$111
  Top 0.152: IC13.4 87.36,115.74 88.96,114.14 R34.1
N$112
  Top 0.152: IC13.2 85.99,113.2 88.96,110.23 R53.1
N$113
  Top 0.152: IC12.8 123,152.91 123.86,153.77 R60.1
N$114
  Top 0.152: IC12.10 119.75,150.37 118.45,151.66 R61.1
N$115
  Top 0.152: R54.1 85.77,118.16 IC13.6
N$116
  Top 0.152: IC13.8 81.9,119.55 82.55,120.19 R55.1
N$117
  Top 0.152: IC12.12 121.63,147.83 121.01,147.21 R62.1
N$118
  Top 0.152: R75.2 102.69,171.91 X7.3
N$119
  Top 0.152: R76.2 65.84,172.13 X6.4
N$120
  Top 0.152: R77.2 62.97,172.2 X6.3
N$123
  Top 0.152: IC13.10 78.17,117.01 76.81,118.36 R56.1
N$124
  Top 0.152: IC13.12 78.75,114.47 78.23,113.95 R57.1
ORD_AR_URG  (via drill 0.35)
  Top 0.152: INT1.15 6.1,135.13 8.89,135.13 14.99,129.03 14.99,102.87 29.97,87.88 v29.97,70.87 | v29.97,39.62 30.23,39.88 132.08,39.88 137.62,34.34 P9.12
  Bottom 0.152: v29.97,70.87 v29.97,39.62
PORTE_DB  (via drill 0.35)
  Top 0.152: INT2.19 4.73,52.2 5.39,52.86 97.89,52.86 102.18,57.15 v116.25,57.15 | v116.25,66.04 116.33,66.04 116.33,71.58 P8.28
  Bottom 0.152: v116.25,57.15 v116.25,66.04
PORTE_DH  (via drill 0.35)
  Top 0.152: INT2.20 97.47,51.32 102.28,56.13 v113.75,56.13 | v113.75,66.04 113.79,66.08 113.79,71.63 114.7,72.54 P8.30
  Bottom 0.152: v113.75,56.13 v113.75,66.04
PORTE_GB  (via drill 0.35)
  Top 0.152: INT2.17 4.87,53.86 5.94,54.93 97.73,54.93 101.76,58.95 115.08,58.95 115.1,58.93 v117.25,58.93 | v117.25,66.04 117.3,66.08 P8.27
  Bottom 0.152: v117.25,58.93 v117.25,66.04
PORTE_GH  (via drill 0.35)
  Top 0.152: INT2.18 97.78,53.86 102.08,58.17 v114.75,58.17 | v114.75,66.04 v114.75,66.05 P8.29
  Bottom 0.152: v114.75,66.04 v114.75,58.17
R2  (via drill 0.35)
  Top 0.152: INT2.15 4.87,56.4 6.11,57.64 98.22,57.64 101.31,60.73 108.58,60.73 108.6,60.71 v126.25,60.71 | v126.25,66.04 126.25,71.33 P8.20
  Bottom 0.152: v126.25,66.04 v126.25,60.71
R3  (via drill 0.35)
  Top 0.152: P8.26 119.83,74.8 117.47,77.17 48.02,77.17 17.55,107.63 17.55,137.41 16,138.96 v16,139.04
  Bottom 0.152: INT1.14 v16,139.04
RST_N  (via drill 0.35)
  Top 0.152: v118.62,44.7 125.48,44.7 146.56,65.79 149.86,65.79 153.14,69.06 153.14,74.7 136.14,91.69 v122.17,91.69 88.14,91.69 v81.43,98.4 | v118.62,34.8 118.69,34.73 118.69,23.13 P9.27 | IC3.1 v81.43,98.4 | IC9.1 123.03,135.48 121.41,133.86 120.4,133.86 v118.36,131.83 | IC6.1 81.43,131.21 v80.52,130.3 | IC1.1 123.03,100.02 v122.17,99.16 | R11.1 80.86,98.97 v81.43,98.4
  Bottom 0.152: v118.62,44.7 v118.62,34.8 | 122.17,98.81 v122.17,91.69 | 122.17,98.81 118.36,102.62 v118.36,131.83 | v80.52,130.3 80.26,130.05 80.26,99.57 v81.43,98.4 | v122.17,99.16 122.17,98.81
SCL  (via drill 0.35)  (1 unrouted)
  Top 0.152: P9.19 127.66,21.74 129.03,23.11 v129.03,34.8 | v129.03,45.72 147.57,64.26 150.86,64.26 155.19,68.6 155.19,75.18 137.16,93.22 v124.71,93.22 88.65,93.22 v82.55,99.31 82.43,99.44 IC3.3 | IC9.3 124.03,134.96 v120.9,131.83 | IC6.3 82.43,130.93 v83.06,130.3 | IC1.3 124.03,99.84 v124.71,99.16
  Bottom 0.152: v129.03,45.72 v129.03,34.8 | 124.71,98.81 v124.71,93.22 | 124.71,98.81 120.9,102.62 v120.9,131.83 | v83.06,130.3 81.79,129.03 81.79,100.08 v82.55,99.31 | v124.71,99.16 124.71,98.81
SDA  (via drill 0.35)
  Top 0.152: v127.51,34.8 127.51,24.33 P9.20 | IC3.2 81.93,98.92 v82.55,98.3 88.39,92.46 v123.44,92.46 136.65,92.46 154.18,74.93 154.18,68.77 150.43,65.02 146.99,65.02 127.51,45.54 v127.51,44.7 | IC9.2 123.53,135.22 121.41,133.1 120.9,133.1 v119.63,131.83 | IC6.2 81.93,130.44 v81.79,130.3 | IC1.2 123.53,99.25 v123.44,99.16 | R12.2 81.52,97.3 v81.53,97.28
  Bottom 0.152: v127.51,44.7 v127.51,34.8 | 123.44,98.81 v123.44,92.46 | 123.44,98.81 119.63,102.62 v119.63,131.83 | v81.79,130.3 81.03,129.54 81.03,99.82 v82.55,98.3 v81.53,97.28 | v123.44,99.16 123.44,98.81

## Text on the board
tPlace: C:/Datas/OneDrive - yncréa/Dossier/Projet M2/Projet 2023 2024/ISEN-Brest_vertical_NB.bmp